# Altium project Final_Filter.PrjPCB
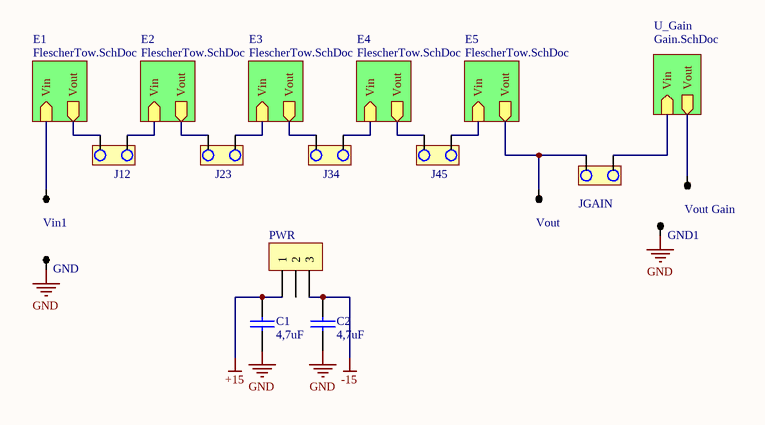
[diagram p0: Esquemático entero.SchDoc]
6 sheets, 117 parts. Net scope: hierarchical (ports join the sheet entries above them; power ports are global).
Board file: Filtro Final.PcbDoc
Sheets:
  Esquemático entero.SchDoc
    E1 = FlescherTow.SchDoc
    E3 = FlescherTow.SchDoc
    E5 = FlescherTow.SchDoc
    U_Gain = Gain.SchDoc
    E2 = FlescherTow.SchDoc
    E4 = FlescherTow.SchDoc
  Sedra LPN.SchDoc
  SEDRA HPN.SchDoc
  OutputLowpas.SchDoc

## Sheet Esquemático entero.SchDoc
size A4

### Parts
(Parts that share a designator on the sheet are numbered #1, #2 ... from top to bottom, then left to right.)
C1#1  4,7uF  [0805]
C2  4,7uF  [0805]
GND  TP  [TPTH]  (value not drawn)
GND1  TP  [TPTH]  (value not drawn)
J12  Connect  [JUMPER2]  (value not drawn)
J23  Connect  [JUMPER2]  (value not drawn)
J34  Connect  [JUMPER2]  (value not drawn)
J45  Connect  [JUMPER2]  (value not drawn)
JGAIN  JUMPER  [JUMPER2]  (value not drawn)
PWR  (no value)  [BORNERA3]
Vin1  TP  [TPTH]  (value not drawn)
Vout  TP  [TPTH]  (value not drawn)
Vout_Gain  TP  [TPTH]  (value not drawn)

### Sub-sheets
E1 = FlescherTow.SchDoc: Vin (in), Vout (out)
E2 = FlescherTow.SchDoc: Vin (in), Vout (out)
E3 = FlescherTow.SchDoc: Vin (in), Vout (out)
E4 = FlescherTow.SchDoc: Vin (in), Vout (out)
E5 = FlescherTow.SchDoc: Vin (in), Vout (out)
U_Gain = Gain.SchDoc: Vin (in), Vout (out)

### Nets
+15: C1#1.2 PWR.1
-15: C2.2 PWR.3
GND: C1#1.1 C2.1 GND.1 GND1.1
NetJ12_1: J12.1 ; sheet E1/Vout
NetJ12_2: J12.2 ; sheet E2/Vin
NetJ23_1: J23.1 ; sheet E2/Vout
NetJ23_2: J23.2 ; sheet E3/Vin
NetJ34_1: J34.1 ; sheet E3/Vout
NetJ34_2: J34.2 ; sheet E4/Vin
NetJ45_1: J45.1 ; sheet E4/Vout
NetJ45_2: J45.2 ; sheet E5/Vin
NetJGAIN_1: JGAIN.1 Vout.1 ; sheet E5/Vout
NetJGAIN_2: JGAIN.2 ; sheet U_Gain/Vin
NetRg2_2: Vout_Gain.1 ; sheet U_Gain/Vout
NetU1_E1_3: Vin1.1 ; sheet E1/Vin

Not connected (* = marked no-connect by the designer): PWR 2

### Library data of the parts
C1#1 C2 = CAP
J12 J23 J34 J45 = JUMPER
PWR = BORNERA 3

## Sheet FlescherTow.SchDoc
size A4
Used 5 times, as channels E1, E3, E5, E2, E4. Parts and nets are listed once, with the designators drawn on the sheet.
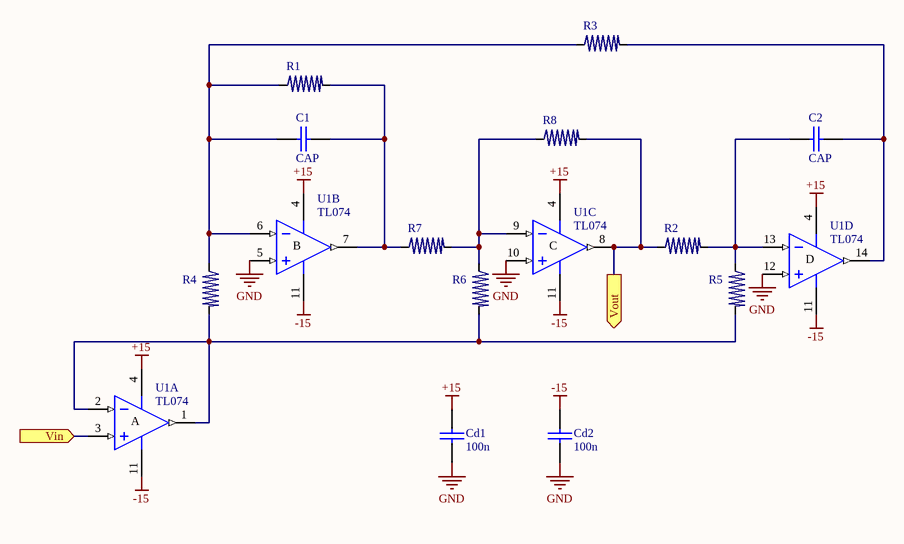
[diagram p1: FlescherTow.SchDoc]

### Parts
C1  CAP  [0805]
C2  CAP  [0805]
Cd1  100n  [0805]
Cd2  100n  [0805]
R1  (no value)  [PCBComponent_1]
R2  (no value)  [PCBComponent_1]
R3  (no value)  [PCBComponent_1]
R4  (no value)  [PCBComponent_1]
R5  (no value)  [PCBComponent_1]
R6  (no value)  [PCBComponent_1]
R7  (no value)  [PCBComponent_1]
R8  (no value)  [PCBComponent_1]
U1  TL074  [J014]  (parts A,B,C,D of 4)

### Ports
Vin (in), Vout (out)

### Nets
+15: Cd1.1 U1.4(V+)
-15: Cd2.1 U1.11(V-)
GND: Cd1.2 Cd2.2 U1.5(IN+) U1.10(IN+) U1.12(IN+)
Vin: U1.3(IN+) ; port Vin
Vout: R2.2 R8.1 U1.8(OUT) ; port Vout
NetC1_1: C1.1 R1.2 R3.2 R4.2 U1.6(IN-)
NetC1_2: C1.2 R1.1 R7.2 U1.7(OUT)
NetC2_1: C2.1 R2.1 R5.2 U1.13(IN-)
NetC2_2: C2.2 R3.1 U1.14(OUT)
NetR4_1: R4.1 R5.1 R6.1 U1.1(OUT) U1.2(IN-)
NetR6_2: R6.2 R7.1 R8.2 U1.9(IN-)

### Channels
E1: designators end in _E1; ports Vin=NetU1_E1_3 Vout=NetJ12_1
E3: designators end in _E3; ports Vin=NetJ23_2 Vout=NetJ34_1
E5: designators end in _E5; ports Vin=NetJ45_2 Vout=NetJGAIN_1
E2: designators end in _E2; ports Vin=NetJ12_2 Vout=NetJ23_1
E4: designators end in _E4; ports Vin=NetJ34_2 Vout=NetJ45_1

### Notes on the sheet
- (in symbol TL074J, part A) A
- (in symbol TL074J, part B) B
- (in symbol TL074J, part C) C
- (in symbol TL074J, part D) D

### Library data of the parts
Cd1 Cd2 = CAP
R1-R8 = SPres
U1 = TL074J: Low-Noise JFET-Input Operational Amplifier; Published: 16-Jan-2001; LatestRevisionDate: 04-Mar-2005; LatestRevisionNote: Stylized 3D Model Added.; DatasheetVersion: Aug-1996; PackageVersion: Jun-1999; PackageReference: J014; Publisher: Altium Limited; PackageDescription: DIP; 14 Leads; Row Spacing 7.62 mm; Pitch 2.54 mm; ComponentLink1Description: Manufacturer Link; ComponentLink1URL: http://www.ti.com/; ComponentLink2Description: Datasheet; ComponentLink2URL: http://www-s.ti.com/sc/ds/tl074.pdf

## Sheet Gain.SchDoc
size A4
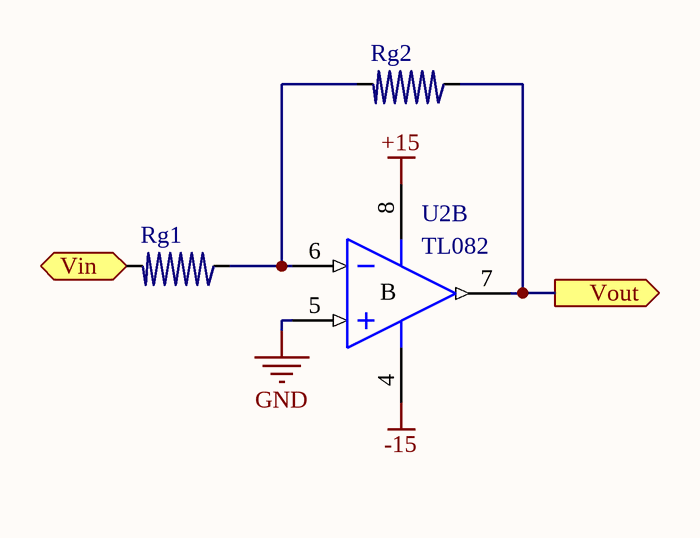
[diagram p2: Gain.SchDoc]

### Parts
(Parts that share a designator on the sheet are numbered #1, #2 ... from top to bottom, then left to right.)
Rg1  (no value)  [PCBComponent_1]
Rg2  (no value)  [PCBComponent_1]
U2#1  TL082  [DIP8]  (part B of 2)

### Ports
Vin (in), Vout (out)

### Nets
+15: U2#1.8(V+)
-15: U2#1.4(V-)
GND: U2#1.5(IN+)
NetJGAIN_2: Rg1.1 ; port Vin
NetRg1_2: Rg1.2 Rg2.1 U2#1.6(IN-)
NetRg2_2: Rg2.2 U2#1.7(OUT) ; port Vout

### Notes on the sheet
- (in symbol TL082AMN, part B) B

### Library data of the parts
Rg1 Rg2 = SPres
U2#1 = TL082AMN: General-Purpose J-FET Dual Operational Amplifier; Published: 24-Aug-2001; LatestRevisionDate: 06-Jun-2005; LatestRevisionNote: Stylized 3D Model Added.; DatasheetVersion: Jan-1999; PackageReference: DIP8; Publisher: Altium Limited; PackageDescription: DIP; 8 Leads; Row Spacing 7.62 mm; Pitch 2.54 mm; Code_JEDEC: MO-001-AN; ComponentLink1Description: Manufacturer Link; ComponentLink1URL: http://www.st.com/; ComponentLink2Description: Datasheet; ComponentLink2URL: http://www.st.com/stonline/products/literature/ds/2300/tl082.pdf

## Sheet Sedra LPN.SchDoc
size A4
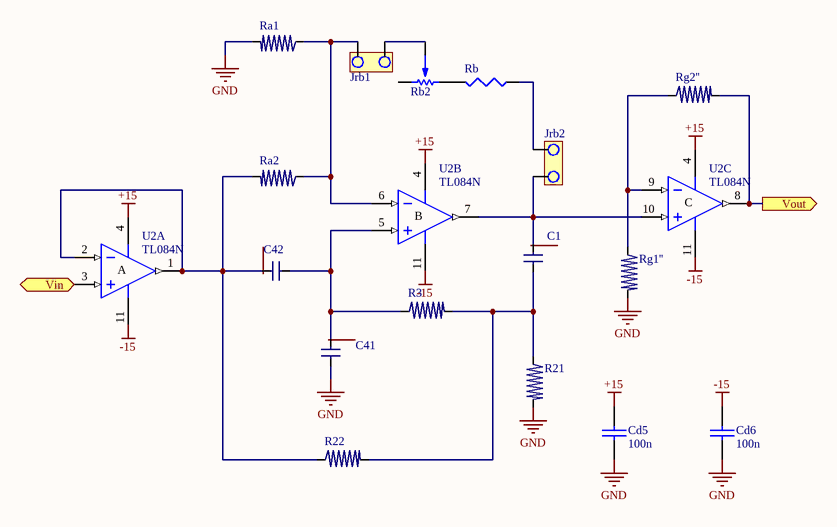
[diagram p3: Sedra LPN.SchDoc]

### Parts
(Parts that share a designator on the sheet are numbered #1, #2 ... from top to bottom, then left to right.)
C1#2  (no value)  [Model Name]
C41  (no value)  [PCBComponent_1]
C42  (no value)  [PCBComponent_1]
Cd5  100n  [CAP200]
Cd6  100n  [CAP200]
Jrb1  (no value)  [JUMPER2]
Jrb2  (no value)  [JUMPER2]
R3  (no value)  [PCBComponent_1]
R21  (no value)  [PCBComponent_1]
R22  (no value)  [PCBComponent_1]
Ra1  (no value)  [PCBComponent_1]
Ra2  (no value)  [PCBComponent_1]
Rb  (no value)  [RES400]
Rb2  (no value)  [PRESET V]
Rg1''  (no value)  [PCBComponent_1]
Rg2''  (no value)  [PCBComponent_1]
U2#2  TL084N  [N014]  (parts A,B,C of 4)

### Ports
Vin (in), Vout (out)

### Nets
+15: Cd5.1 U2#2.4(V+)
-15: Cd6.1 U2#2.11(V-)
GND: C41.1 Cd5.2 Cd6.2 R21.1 Ra1.1 Rg1''.1
NetC1#2_1: C1#2.1 R3.1 R21.2 R22.1
NetC1#2_2: C1#2.2 Jrb2.1 U2#2.7(OUT) U2#2.10(IN+)
NetC41_2: C41.2 C42.1 R3.2 U2#2.5(IN+)
NetC42_2: C42.2 R22.2 Ra2.1 U2#2.1(OUT) U2#2.2(IN-)
NetJrb1_1: Jrb1.1 Ra1.2 Ra2.2 U2#2.6(IN-)
NetJrb1_2: Jrb1.2 Rb2.2
NetJrb2_2: Jrb2.2 Rb.1
NetRb_2: Rb.2 Rb2.3
NetRg1''_2: Rg1''.2 Rg2''.2 U2#2.9(IN-)
NetRg2''_1: Rg2''.1 U2#2.8(OUT) ; port Vout
NetU2#2_3: U2#2.3(IN+) ; port Vin

Not connected (* = marked no-connect by the designer): Rb2 1

### Notes on the sheet
- (in symbol TL084N, part A) A
- (in symbol TL084N, part B) B
- (in symbol TL084N, part C) C

### Library data of the parts
C1#2 C41 C42 = Sheet1
Cd5 Cd6 = CAP
Jrb1 Jrb2 = JUMPER
R3 R21 R22 Ra1 Ra2 Rg1'' Rg2'' = SPres
Rb = Res3: Resistor; Published: 8-Jun-2000; LatestRevisionDate: 29-May-2009; LatestRevisionNote: IPC-7351 Footprint Added.; PackageReference: J1-0603; Publisher: Altium Limited; PackageDescription: Chip Resistor
Rb2 = PRESET
U2#2 = TL084N: JFET-Input Operational Amplifier; Published: 16-Jan-2001; LatestRevisionDate: 04-Mar-2005; LatestRevisionNote: Stylized 3D Model Added.; DatasheetVersion: Feb-1999; PackageVersion: Oct-1995; PackageReference: N014; Publisher: Altium Limited; PackageDescription: DIP; 14 Leads; Row Spacing 7.62 mm; Pitch 2.54 mm; ComponentLink1Description: Manufacturer Link; ComponentLink1URL: http://www.ti.com/; ComponentLink2Description: Datasheet; ComponentLink2URL: http://www-s.ti.com/sc/ds/tl084.pdf

## Sheet SEDRA HPN.SchDoc
size A4
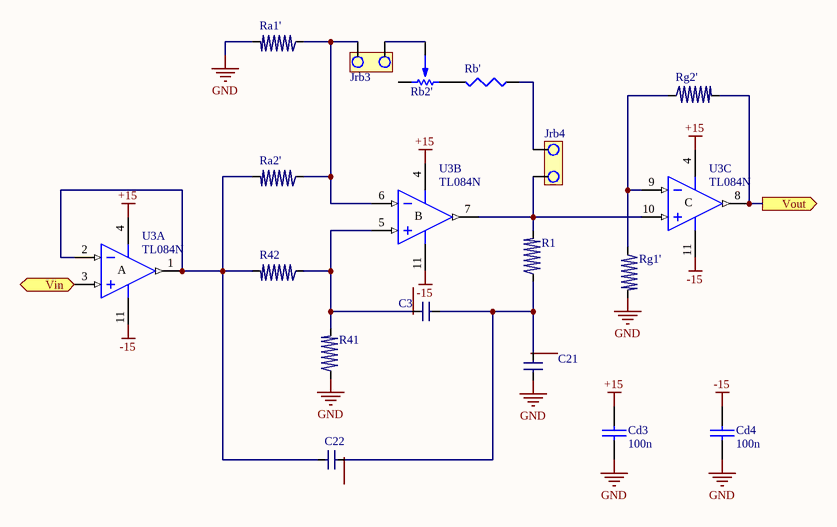
[diagram p4: SEDRA HPN.SchDoc]

### Parts
C3  (no value)  [Model Name]
C21  (no value)
C22  (no value)  [Model Name]
Cd3  100n  [CAP200]
Cd4  100n  [CAP200]
Jrb3  (no value)  [JUMPER2]
Jrb4  (no value)  [JUMPER2]
R1  (no value)  [PCBComponent_1]
R41  (no value)  [PCBComponent_1]
R42  (no value)  [PCBComponent_1]
Ra1'  (no value)  [PCBComponent_1]
Ra2'  (no value)  [PCBComponent_1]
Rb2'  (no value)  [PRESET V]
Rb'  (no value)  [RES400]
Rg1'  (no value)  [PCBComponent_1]
Rg2'  (no value)  [PCBComponent_1]
U3  TL084N  [N014]  (parts A,B,C of 4)

### Ports
Vin (in), Vout (out)

### Nets
+15: Cd3.1 U3.4(V+)
-15: Cd4.1 U3.11(V-)
GND: C21.1 Cd3.2 Cd4.2 R41.2 Ra1'.1 Rg1'.1
NetC3_1: C3.1 C21.2 C22.2 R1.2
NetC3_2: C3.2 R41.1 R42.2 U3.5(IN+)
NetC22_1: C22.1 R42.1 Ra2'.1 U3.1(OUT) U3.2(IN-)
NetJrb3_1: Jrb3.1 Ra1'.2 Ra2'.2 U3.6(IN-)
NetJrb3_2: Jrb3.2 Rb2'.2
NetJrb4_1: Jrb4.1 R1.1 U3.7(OUT) U3.10(IN+)
NetJrb4_2: Jrb4.2 Rb'.1
NetRb2'_3: Rb2'.3 Rb'.2
NetRg1'_2: Rg1'.2 Rg2'.2 U3.9(IN-)
NetRg2'_1: Rg2'.1 U3.8(OUT) ; port Vout
NetU3_3: U3.3(IN+) ; port Vin

Not connected (* = marked no-connect by the designer): Rb2' 1

### Notes on the sheet
- (in symbol TL084N, part A) A
- (in symbol TL084N, part B) B
- (in symbol TL084N, part C) C

### Library data of the parts
C3 C21 C22 = Sheet1
Cd3 Cd4 = CAP
Jrb3 Jrb4 = JUMPER
R1 R41 R42 Ra1' Ra2' Rg1' Rg2' = SPres
Rb2' = PRESET
Rb' = Res3: Resistor; Published: 8-Jun-2000; LatestRevisionDate: 29-May-2009; LatestRevisionNote: IPC-7351 Footprint Added.; PackageReference: J1-0603; Publisher: Altium Limited; PackageDescription: Chip Resistor
U3 = TL084N: JFET-Input Operational Amplifier; Published: 16-Jan-2001; LatestRevisionDate: 04-Mar-2005; LatestRevisionNote: Stylized 3D Model Added.; DatasheetVersion: Feb-1999; PackageVersion: Oct-1995; PackageReference: N014; Publisher: Altium Limited; PackageDescription: DIP; 14 Leads; Row Spacing 7.62 mm; Pitch 2.54 mm; ComponentLink1Description: Manufacturer Link; ComponentLink1URL: http://www.ti.com/; ComponentLink2Description: Datasheet; ComponentLink2URL: http://www-s.ti.com/sc/ds/tl084.pdf

## Sheet OutputLowpas.SchDoc
size A4
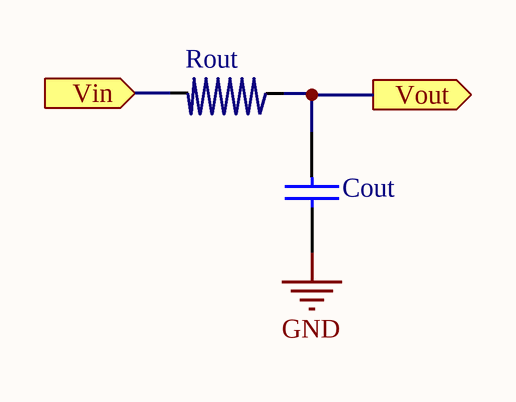
[diagram p5: OutputLowpas.SchDoc]

### Parts
Cout  (no value)  [0805]
Rout  (no value)  [PCBComponent_1]

### Ports
Vin (in), Vout (out)

### Nets
GND: Cout.2
NetCout_1: Cout.1 Rout.2 ; port Vout
NetRout_1: Rout.1 ; port Vin

### Library data of the parts
Cout = CAP
Rout = SPres

## Nets that join several sheets
+15: Esquemático entero (C1#1.2 PWR.1), E1 (Cd1_E1.1 U1_E1.4), E3 (Cd1_E3.1 U1_E3.4), E5 (Cd1_E5.1 U1_E5.4), Gain (U2#1.8), E2 (Cd1_E2.1 U1_E2.4), E4 (Cd1_E4.1 U1_E4.4), Sedra LPN (Cd5.1 U2#2.4), SEDRA HPN (Cd3.1 U3.4)
-15: Esquemático entero (C2.2 PWR.3), E1 (Cd2_E1.1 U1_E1.11), E3 (Cd2_E3.1 U1_E3.11), E5 (Cd2_E5.1 U1_E5.11), Gain (U2#1.4), E2 (Cd2_E2.1 U1_E2.11), E4 (Cd2_E4.1 U1_E4.11), Sedra LPN (Cd6.1 U2#2.11), SEDRA HPN (Cd4.1 U3.11)
GND: Esquemático entero (C1#1.1 C2.1 GND.1 GND1.1), E1 (5 pins), E3 (5 pins), E5 (5 pins), Gain (U2#1.5), E2 (5 pins), E4 (5 pins), Sedra LPN (6 pins), SEDRA HPN (6 pins), OutputLowpas (Cout.2)
NetJ12_1: Esquemático entero (J12.1), E1 (R2_E1.2 R8_E1.1 U1_E1.8)
NetJ12_2: Esquemático entero (J12.2), E2 (U1_E2.3)
NetJ23_1: Esquemático entero (J23.1), E2 (R2_E2.2 R8_E2.1 U1_E2.8)
NetJ23_2: Esquemático entero (J23.2), E3 (U1_E3.3)
NetJ34_1: Esquemático entero (J34.1), E3 (R2_E3.2 R8_E3.1 U1_E3.8)
NetJ34_2: Esquemático entero (J34.2), E4 (U1_E4.3)
NetJ45_1: Esquemático entero (J45.1), E4 (R2_E4.2 R8_E4.1 U1_E4.8)
NetJ45_2: Esquemático entero (J45.2), E5 (U1_E5.3)
NetJGAIN_1: Esquemático entero (JGAIN.1 Vout.1), E5 (R2_E5.2 R8_E5.1 U1_E5.8)
NetJGAIN_2: Esquemático entero (JGAIN.2), Gain (Rg1.1)
NetRg2_2: Esquemático entero (Vout_Gain.1), Gain (Rg2.2 U2#1.7)
NetU1_E1_3: Esquemático entero (Vin1.1), E1 (U1_E1.3)